# Altium schematic sheet BQ7930_Schem.SchDoc
size C
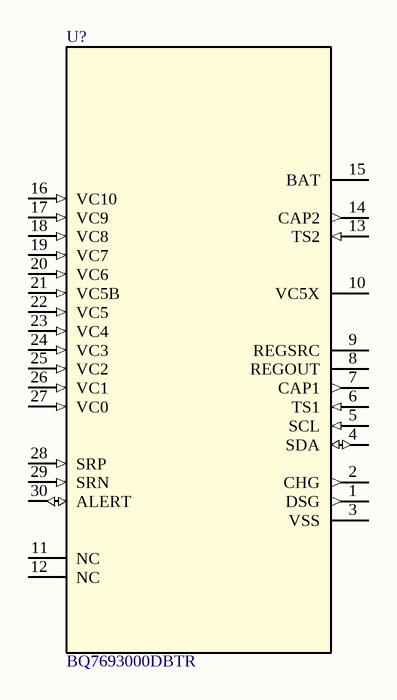
[diagram p0: BQ7930_Schem.SchDoc]

## Parts
U?  BQ7693000DBTR  [DBT0030A_N]

## Nets

Not connected (* = marked no-connect by the designer): U? 1(DSG) 2(CHG) 3(VSS) 4(SDA) 5(SCL) 6(TS1) 7(CAP1) 8(REGOUT) 9(REGSRC) 10(VC5X) 11(NC) 12(NC) 13(TS2) 14(CAP2) 15(BAT) 16(VC10) 17(VC9) 18(VC8) 19(VC7) 20(VC6) 21(VC5B) 22(VC5) 23(VC4) 24(VC3) 25(VC2) 26(VC1) 27(VC0) 28(SRP) 29(SRN) 30(ALERT)

## Library data of the parts
U? = BQ7693000DBTR: Imported; Manufacturer: Texas Instruments; PartNumber: BQ7693000DBTR; RefDes: RefDes; TYPE: TYPE; Value: Value